# Altium schematic sheet SingleBoardDrone_RP2350.SchDoc
size B; SheetNumber: 2; SheetTotal: 5
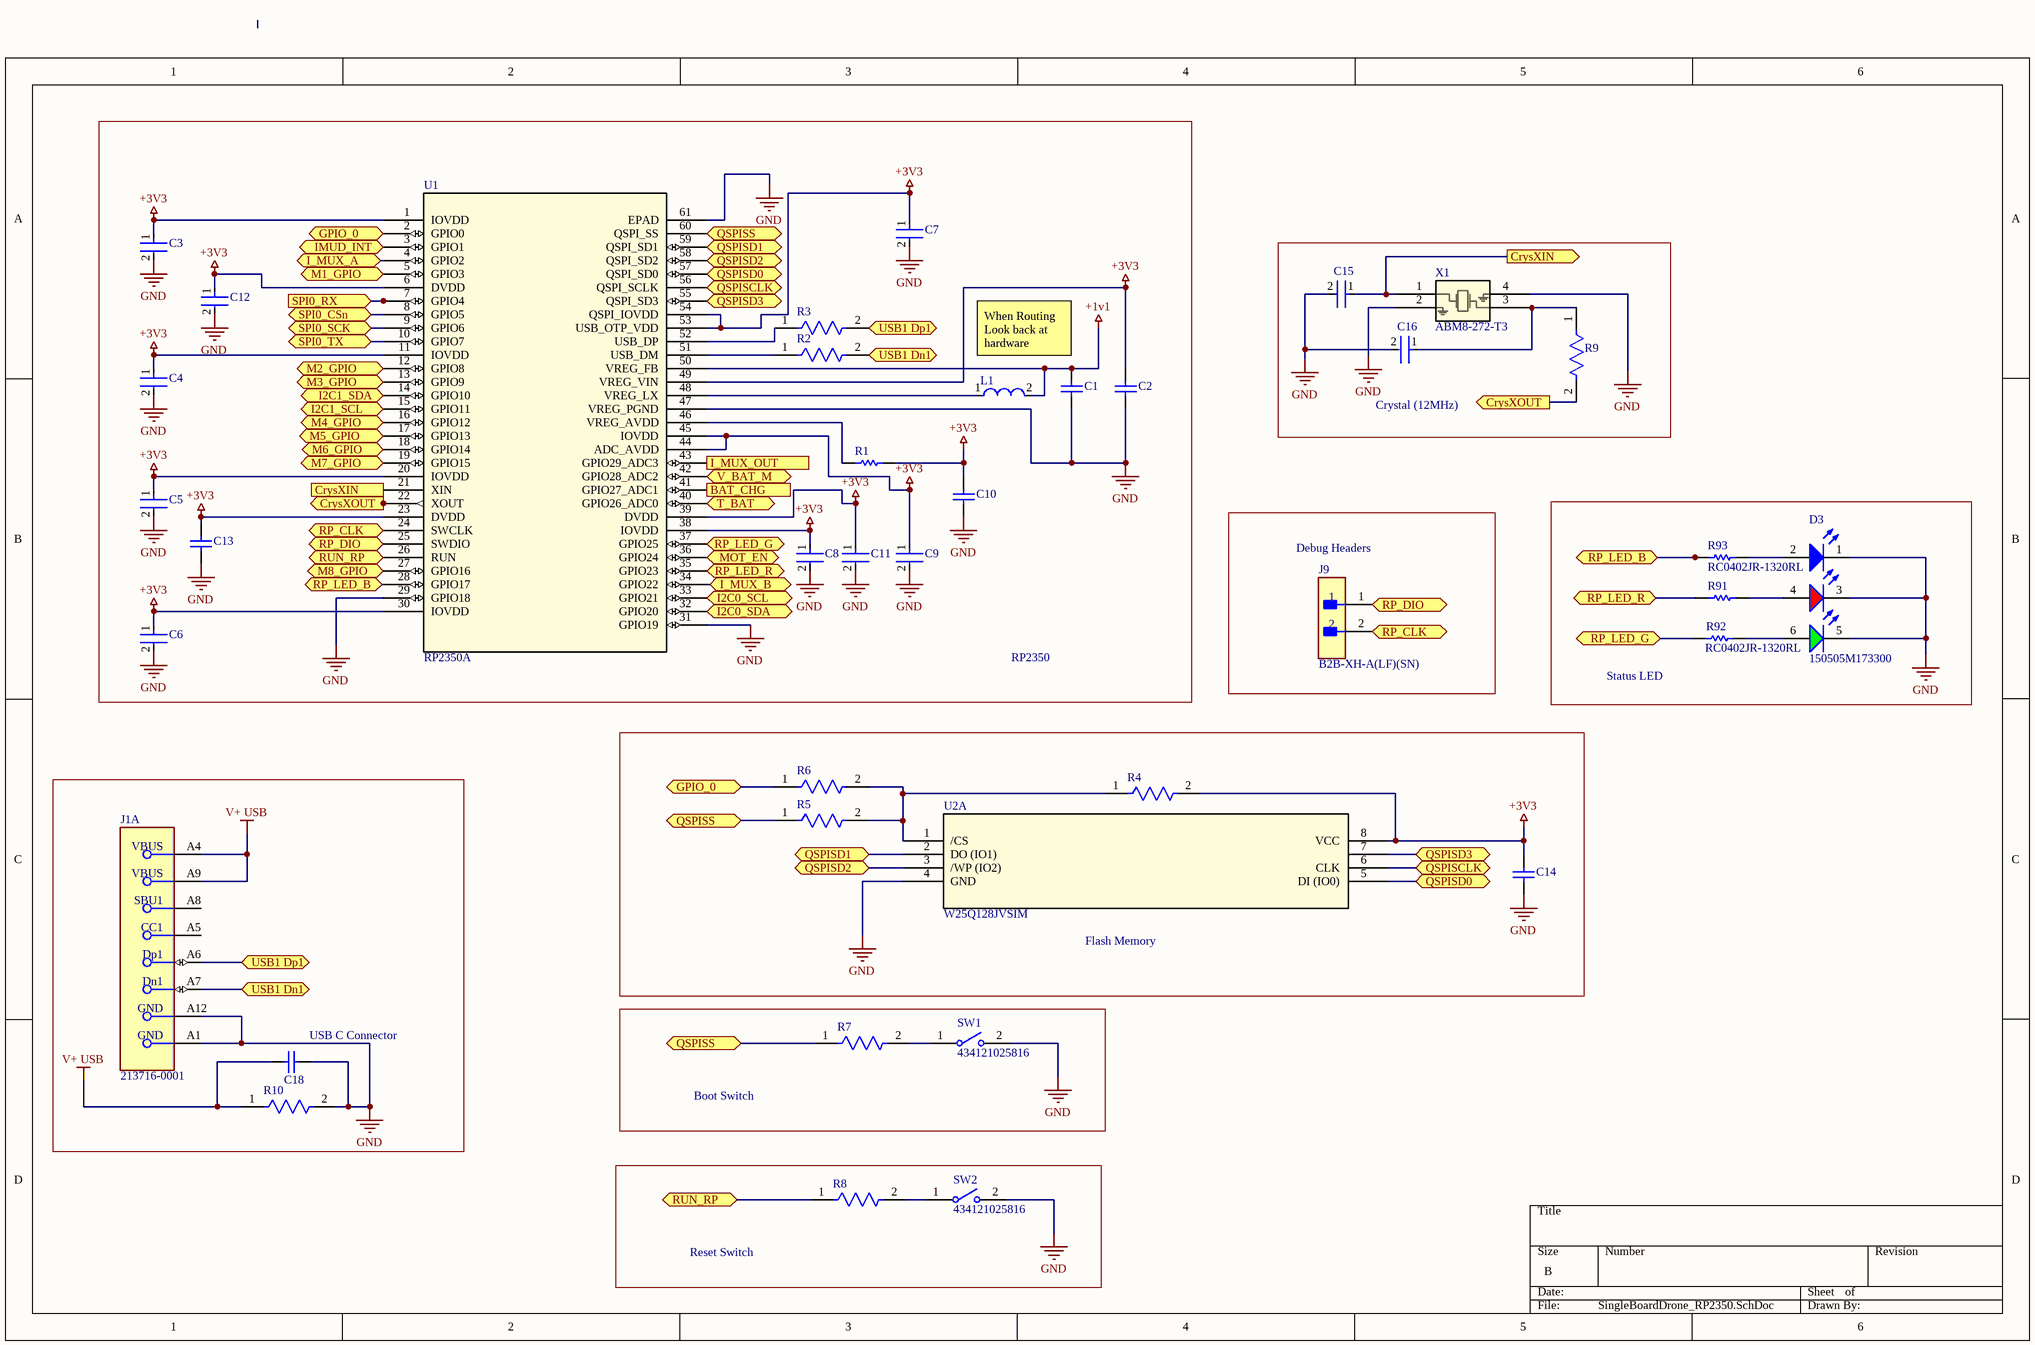
[diagram p0: SingleBoardDrone_RP2350.SchDoc]

## Parts
C1  CL10A475KQ8NNNC  [CAPC1608X90X30LL10T20]  (value not drawn)
C2  CL10A475KQ8NNNC  [CAPC1608X90X30LL10T20]  (value not drawn)
C3  CL03A104KP3NNNC  [FP-CL03-IPC_C]  (value not drawn)
C4  CL03A104KP3NNNC  [FP-CL03-IPC_C]  (value not drawn)
C5  CL03A104KP3NNNC  [FP-CL03-IPC_C]  (value not drawn)
C6  CL03A104KP3NNNC  [FP-CL03-IPC_C]  (value not drawn)
C7  CL03A104KP3NNNC  [FP-CL03-IPC_C]  (value not drawn)
C8  CL03A104KP3NNNC  [FP-CL03-IPC_C]  (value not drawn)
C9  CL03A104KP3NNNC  [FP-CL03-IPC_C]  (value not drawn)
C10  CL10A475KQ8NNNC  [CAPC1608X90X30LL10T20]  (value not drawn)
C11  CL03A104KP3NNNC  [FP-CL03-IPC_C]  (value not drawn)
C12  CL03A104KP3NNNC  [FP-CL03-IPC_C]  (value not drawn)
C13  CL10A475KQ8NNNC  [CAPC1608X90X30LL10T20]  (value not drawn)
C14  CL10A475KQ8NNNC  [CAPC1608X90X30LL10T20]  (value not drawn)
C15  CC0402JRNPO9BN150  [FP-CC0402-0_55-IPC_B]  (value not drawn)
C16  CC0402JRNPO9BN150  [FP-CC0402-0_55-IPC_B]  (value not drawn)
C18  CL10A475KQ8NNNC  [CAPC1608X90X30LL10T20]  (value not drawn)
D3  150505M173300  [WL-SFTW_5050_150505M173300]
J1  213716-0001  [FP-213716-0001-MFG]  (part A of 3)
J9  B2B-XH-A(LF)(SN)  [FP-B2B-XH-A_LF_SN-MFG]
L1  MLZ2012A3R3WT000  [FP-MLZ2012-0_85-IPC_C]  (value not drawn)
R1  RC0603JR-1333RL  [RESC1608X55X25LL10T15]  (value not drawn)
R2  AC0402FR-0727RL  [FP-AC0402-IPC_C]  (value not drawn)
R3  AC0402FR-0727RL  [FP-AC0402-IPC_C]  (value not drawn)
R4  RMCF0603JG10K0  [FP-RMCF0603-MFG]  (value not drawn)
R5  RC0402FR-070RL  [FP-RC0402-0_4-IPC_A]  (value not drawn)
R6  RC0402FR-070RL  [FP-RC0402-0_4-IPC_A]  (value not drawn)
R7  RMCF0402JT1K00  [FP-RMCF0402-IPC_B]  (value not drawn)
R8  RMCF0402JT1K00  [FP-RMCF0402-IPC_B]  (value not drawn)
R9  RMCF0402JT1K00  [FP-RMCF0402-IPC_B]  (value not drawn)
R10  RMCF0603JG10K0  [FP-RMCF0603-MFG]  (value not drawn)
R91  ERJ-3EKF1400V  [RESC1608X55X30NL15T15]  (value not drawn)
R92  RC0402JR-1320RL  [RESC1005X40X25NL05T10]
R93  RC0402JR-1320RL  [RESC1005X40X25NL05T10]
SW1  434121025816  [434121025816]
SW2  434121025816  [434121025816]
U1  RP2350A  [QFN-60_7X7_RPI]
U2  W25Q128JVSIM  [SOIC_128JVSIM_WIN]  (part A of 2)
X1  ABM8-272-T3  [XTAL_ABM8-272-T3]

## Blocks framed on the sheet
RP2350: C1-C13 L1 R1-R3 U1
Crystal (12MHz): C15 C16 R9 X1
Status LED: D3 R91-R93
Debug Headers: J9
Flash Memory: C14 R4-R6 U2
USB C Connector: C18 J1 R10
Boot Switch: R7 SW1
Reset Switch: R8 SW2

## Ports
BAT_CHG (in, see SingleBoardDrone_Pow[2C]), CrysXIN (in, see SingleBoardDrone_RP2350[5A]), CrysXIN (out, see SingleBoardDrone_RP2350[1B]), CrysXOUT (out, see SingleBoardDrone_RP2350[1B]), CrysXOUT (out, see SingleBoardDrone_RP2350[5B]), GPIO_0 (bidir, see SingleBoardDrone_Act[5C], SingleBoardDrone_RP2350[1A]), GPIO_0 (bidir, see SingleBoardDrone_Act[5C], SingleBoardDrone_RP2350[2C]), I2C0_SCL (bidir, see SingleBoardDrone_Sens[3A], SingleBoardDrone_Sens[3C]), I2C0_SDA (bidir, see SingleBoardDrone_Sens[3A], SingleBoardDrone_Sens[3C]), I2C1_SCL (bidir, see SingleBoardDrone_RF[3B]), I2C1_SDA (bidir, see SingleBoardDrone_RF[3B]), I_MUX_A (bidir, see SingleBoardDrone_Act[5C]), I_MUX_B (bidir, see SingleBoardDrone_Act[5C]), I_MUX_OUT (in, see SingleBoardDrone_Act[5D]), IMUD_INT (bidir, see SingleBoardDrone_Sens[2C], SingleBoardDrone_Sens[3B]), M1_GPIO (bidir, see SingleBoardDrone_Act[2A]), M2_GPIO (bidir, see SingleBoardDrone_Act[2A]), M3_GPIO (bidir, see SingleBoardDrone_Act[4A]), M4_GPIO (bidir, see SingleBoardDrone_Act[4A]), M5_GPIO (bidir, see SingleBoardDrone_Act[2C]), M6_GPIO (bidir, see SingleBoardDrone_Act[2C]), M7_GPIO (bidir, see SingleBoardDrone_Act[4C]), M8_GPIO (bidir, see SingleBoardDrone_Act[4C]), MOT_EN (bidir, see SingleBoardDrone_Act[6B]), QSPISCLK (bidir, see SingleBoardDrone_RP2350[3A]), QSPISCLK (bidir, see SingleBoardDrone_RP2350[5C]), QSPISD0 (bidir, see SingleBoardDrone_RP2350[3A]), QSPISD0 (bidir, see SingleBoardDrone_RP2350[5C]), QSPISD1 (bidir, see SingleBoardDrone_RP2350[3A]), QSPISD1 (bidir, see SingleBoardDrone_RP2350[3C]), QSPISD2 (bidir, see SingleBoardDrone_RP2350[3A]), QSPISD2 (bidir, see SingleBoardDrone_RP2350[3C]), QSPISD3 (bidir, see SingleBoardDrone_RP2350[3A]), QSPISD3 (bidir, see SingleBoardDrone_RP2350[5C]), QSPISS (bidir, see SingleBoardDrone_RP2350[2C], SingleBoardDrone_RP2350[2D]), QSPISS (bidir, see SingleBoardDrone_RP2350[2C], SingleBoardDrone_RP2350[3A]), QSPISS (bidir, see SingleBoardDrone_RP2350[2D], SingleBoardDrone_RP2350[3A]), RP_CLK (bidir, see SingleBoardDrone_RP2350[1B]), RP_CLK (bidir, see SingleBoardDrone_RP2350[5B]), RP_DIO (bidir, see SingleBoardDrone_RP2350[1B]), RP_DIO (bidir, see SingleBoardDrone_RP2350[5B]), RP_LED_B (bidir, see SingleBoardDrone_RP2350[1B]), RP_LED_B (bidir, see SingleBoardDrone_RP2350[5B]), RP_LED_G (bidir, see SingleBoardDrone_RP2350[3B]), RP_LED_G (bidir, see SingleBoardDrone_RP2350[5B]), RP_LED_R (bidir, see SingleBoardDrone_RP2350[3B]), RP_LED_R (bidir, see SingleBoardDrone_RP2350[5B]), RUN_RP (bidir, see SingleBoardDrone_RP2350[1B]), RUN_RP (bidir, see SingleBoardDrone_RP2350[2D]), SPI0_CSn (bidir, see SingleBoardDrone_Sens[1A]), SPI0_RX (in, see SingleBoardDrone_Sens[2A]), SPI0_SCK (bidir, see SingleBoardDrone_Sens[1A]), SPI0_TX (bidir, see SingleBoardDrone_Sens[2A]), T_BAT (bidir, see SingleBoardDrone_Pow[1B]), USB1 Dn1 (bidir, see SingleBoardDrone_RP2350[1C]), USB1 Dn1 (bidir, see SingleBoardDrone_RP2350[3A]), USB1 Dp1 (bidir, see SingleBoardDrone_RP2350[1C]), USB1 Dp1 (bidir, see SingleBoardDrone_RP2350[3A]), V_BAT_M (bidir, see SingleBoardDrone_Pow[2A])

## Nets
+1v1: C1.1 L1.2 U1.50(VREG_FB)
+3V3: C2.1 C3.1 C4.1 C5.1 C6.1 C7.1 C8.1 C9.1 C10.1 C11.1 C12.1 C13.1 C14.1 R1.2 R4.2 U1.1(IOVDD) U1.6(DVDD) U1.11(IOVDD) U1.20(IOVDD) U1.23(DVDD) U1.30(IOVDD) U1.38(IOVDD) U1.39(DVDD) U1.44(ADC_AVDD) U1.45(IOVDD) U1.49(VREG_VIN) U1.53(USB_OTP_VDD) U1.54(QSPI_IOVDD) U2.8(VCC)
GND: C1.2 C2.2 C3.2 C4.2 C5.2 C6.2 C7.2 C8.2 C9.2 C10.2 C11.2 C12.2 C13.2 C14.2 C15.2 C16.2 C18.1 D3.1(K) D3.3(K) D3.5(K) J1.A1(GND) J1.A12(GND) R10.2 SW1.2 SW2.2 U1.29(GPIO18) U1.31(GPIO19) U1.47(VREG_PGND) U1.61(EPAD) U2.4(GND) X1.2 X1.4
V+ USB: C18.2 J1.A4(VBUS) J1.A9(VBUS) R10.1
BAT_CHG: U1.41(GPIO27_ADC1) ; port BAT_CHG
CrysXIN: C15.1 U1.21(XIN) X1.1 ; port CrysXIN
CrysXOUT: R9.2 U1.22(XOUT) ; port CrysXOUT
GPIO_0: R6.1 U1.2(GPIO0) ; port GPIO_0
I2C0_SCL: U1.33(GPIO21) ; port I2C0_SCL
I2C0_SDA: U1.32(GPIO20) ; port I2C0_SDA
I2C1_SCL: U1.15(GPIO11) ; port I2C1_SCL
I2C1_SDA: U1.14(GPIO10) ; port I2C1_SDA
I_MUX_A: U1.4(GPIO2) ; port I_MUX_A
I_MUX_B: U1.34(GPIO22) ; port I_MUX_B
I_MUX_OUT: U1.43(GPIO29_ADC3) ; port I_MUX_OUT
IMUD_INT: U1.3(GPIO1) ; port IMUD_INT
M1_GPIO: U1.5(GPIO3) ; port M1_GPIO
M2_GPIO: U1.12(GPIO8) ; port M2_GPIO
M3_GPIO: U1.13(GPIO9) ; port M3_GPIO
M4_GPIO: U1.16(GPIO12) ; port M4_GPIO
M5_GPIO: U1.17(GPIO13) ; port M5_GPIO
M6_GPIO: U1.18(GPIO14) ; port M6_GPIO
M7_GPIO: U1.19(GPIO15) ; port M7_GPIO
M8_GPIO: U1.27(GPIO16) ; port M8_GPIO
MOT_EN: U1.36(GPIO24) ; port MOT_EN
QSPISCLK: U1.56(QSPI_SCLK) U2.6(CLK) ; port QSPISCLK
QSPISD0: U1.57(QSPI_SD0) U2.5(DI_(IO0)) ; port QSPISD0
QSPISD1: U1.59(QSPI_SD1) U2.2(DO_(IO1)) ; port QSPISD1
QSPISD2: U1.58(QSPI_SD2) U2.3(/WP_(IO2)) ; port QSPISD2
QSPISD3: U1.55(QSPI_SD3) U2.7 ; port QSPISD3
QSPISS: R5.1 R7.1 U1.60(QSPI_SS) ; port QSPISS
RP_CLK: J9.2 U1.24(SWCLK) ; port RP_CLK
RP_DIO: J9.1 U1.25(SWDIO) ; port RP_DIO
RP_LED_B: R93.1 U1.28(GPIO17) ; port RP_LED_B
RP_LED_G: R92.1 U1.37(GPIO25) ; port RP_LED_G
RP_LED_R: R91.1 U1.35(GPIO23) ; port RP_LED_R
RUN_RP: R8.1 U1.26(RUN) ; port RUN_RP
SPI0_CSn: U1.8(GPIO5) ; port SPI0_CSn
SPI0_RX: U1.7(GPIO4) ; port SPI0_RX
SPI0_SCK: U1.9(GPIO6) ; port SPI0_SCK
SPI0_TX: U1.10(GPIO7) ; port SPI0_TX
T_BAT: U1.40(GPIO26_ADC0) ; port T_BAT
USB1 Dn1: J1.A7(Dn1) R2.2 ; port USB1 Dn1
USB1 Dp1: J1.A6(Dp1) R3.2 ; port USB1 Dp1
V_BAT_M: U1.42(GPIO28_ADC2) ; port V_BAT_M
NetC16_1: C16.1 R9.1 X1.3
NetD3_2: D3.2(A) R93.2
NetD3_4: D3.4(A) R91.2
NetD3_6: D3.6(A) R92.2
NetL1_1: L1.1 U1.48(VREG_LX)
NetR1_1: R1.1 U1.46(VREG_AVDD)
NetR2_1: R2.1 U1.51(USB_DM)
NetR3_1: R3.1 U1.52(USB_DP)
NetR4_1: R4.1 R5.2 R6.2 U2.1(/CS)
NetR7_2: R7.2 SW1.1
NetR8_2: R8.2 SW2.1

Not connected (* = marked no-connect by the designer): J1 A5(CC1) A8(SBU1)

## Notes on the sheet
- When Routing Look back at hardware guide... they have an ideal oreitnation for the inductor....
  They recomend aota-b201610s3r3-101-t

## Library data of the parts
C1 C2 C10 C13 C14 C18 = CMP-2000-06090-1: Chip Capacitor, 4.7 uF, +/- 10%, 6.3 V, -55 to 85 degC, 0603 (1608 Metric), RoHS, Tape and Reel; Manufacturer: Samsung Electro-Mechanics; Dielectric: X5R; Capacitance: 4700000pF; Rated Voltage: 6.3V; Manufacturer URL: http://www.samsungsem.com/global/index.jsp; Case Size/Dimension: 0603; Package Description: 2-Pin Surface Mount Device, Body 1.60 x 0.80 mm; Datasheet Version: 07/2016; Datasheet URL: http://www.samsungsem.com/kr/support/product-search/mlcc/__icsFiles/afieldfile/2016/08/18/S_CL10A475KQ8NNNC.pdf; Tolerance (%): ±10%; Mounting Technology: SurfaceMount; Package Reference: 0603
C3-C9 C11 C12 = CMP-2010-00672-2: Cap Ceramic 100nF 10V X5R ±10% Pad SMD 0201 +85°C T/R; Radiation Hardening: No; Voltage Rating: 10V; Dielectric: X5R; Length: 0.6mm; Voltage Rating (DC): 10V; Package Quantity: 1; Height: 0.3mm; Width: 0.012inch; Min Operating Temperature: -55°C; Lead Free: Lead Free; Tolerance: 10%; Contact Plating: Tin; Depth: 0.3mm; Max Operating Temperature: 85°C; Case/Package: 0201; Capacitance: 100nF; Mount: Surface Mount; Thickness: 0.013inch; Case Code (Metric): 0603; Case Code (Imperial): 0201; Packaging: Tape and Reel
C15 C16 = CMP-03422-001519-1: CAP CER 15PF 50V C0G/NPO 0402; Insulation Resistance: 100GR; Dielectric Material: Ceramic; Tolerance: 5%; Dielectric: C0G; Width: 0.02inch; Case Code (Imperial): 0402; Voltage Rating (DC): 50V; Case Code (Metric): 1005; REACH SVHC: No SVHC; Mount: Surface Mount; Min Operating Temperature: -55°C; Depth: 0.5mm; Voltage Rating: 50V; Voltage: 50V; Thickness: 0.022inch; Length: 1mm; Max Operating Temperature: 125°C; Lead Free: Lead Free; Capacitance: 15pF; Height: 0.5mm; Packaging: Tape and Reel; Radiation Hardening: No; Package Quantity: 1; Case/Package: 0402; Number of Pins: 2; RoHS Compliant: Yes; Resistor Type: Ceramic; Series: CC; Termination: SMD/SMT
D3 = CMP-03913-90235585-1: 150505M173300 WL-SFTW SMT full-color TOP LED waterclear; Max Reverse Voltage (DC): 5V; Forward Current: 80mA; Max Junction Temperature (Tj): 115°C; Peak Wavelength: 465nm; Color: Blue, Green, Red; Viewing Angle: 120°; Luminous Intensity: 350mcd; Dominant Wavelength: 520nm; Forward Voltage: 2V; Power Dissipation: 72mW; Length: 5.4mm; Width: 5mm; Min Operating Temperature: -40°C; Height: 1.5mm; Packaging: Tape and Reel; Max Operating Temperature: 85°C; RoHS: Compliant; Reverse Voltage: 5V; NexarPartId: 90235585
J1 = CMP-04767-000029-1: CONN RCPT USB2.0 TYPE C 24POS RA
J9 = CMP-2000-05888-3: CONN HEADER VERT 2POS 2.5MM; Current Rating: 3A; Voltage Rating: 250V; Number of Contacts: 2; Contact Resistance: 20mR; Wire/Cable Gauge: 22AWG; Insulation Resistance: 1GR; Connector Type: Male Pin; Packaging: Bulk; Contact Material: Brass; Lead Free: Lead Free; Orientation: Straight; Contact Plating: Tin; Max Current Rating: 3A; Termination: Solder; Fastening Type: Detent; Depth: 5.75mm; Housing Material: Polyamide; REACH SVHC: No SVHC; Series: XH; Voltage Rating (AC): 250V; Number of Positions: 2; Color: Natural; Contact Type: Male Pin; Max Voltage Rating (DC): 250V; Pitch: 2.5mm; Lead Pitch: 2.5mm; Mount: Through Hole; Max Operating Temperature: 85°C; Length: 7.4mm; Max Voltage Rating (AC): 250V; Min Operating Temperature: -25°C; Number of Rows: 1; Housing Color: White
L1 = CMP-08253-000308-1: Shielded Multilayer Inductor 3.3uH ±20% 450mA 442mΩ SMD 0805; Saturation Current: 200mA; Self Resonant Frequency: 90MHz; DC Resistance (DCR): 442mR; Core Material: Ferrite; Test Frequency: 10MHz; Current Rating: 450mA; Shielding: Shielded; Lead Free: Lead Free; Length: 0.079inch; Inductance: 3.3uH; Max Operating Temperature: 125°C; Height - Seated (Max): 0.041inch; Tolerance: 20%; Mount: Surface Mount; Package Quantity: 1; Case/Package: 0805; Case Code (Metric): 2012; Min Operating Temperature: -55°C; Packaging: Cut Tape; RoHS Compliant: Yes; Case Code (Imperial): 0805; Width: 0.049inch
R1 = CMP-2000-04324-1: Manufacturer: Yageo; Part Number: RC0603JR-1333RL
R2 R3 = CMP-03412-005338-2: RES 27Ω ±1% 0.063W 0402; Temperature Coefficient: 100ppm/°C; Max Power Dissipation: 63mW; Resistance: 27R; Series: AC; Tolerance: 1%; Length: 0.039inch; Number of Terminations: 2; Case/Package: 0402; Features: Moisture Resistant; Min Operating Temperature: -55°C; Max Operating Temperature: 155°C; Resistor Type: Thick Film; Width: 0.02inch; RoHS Compliant: Yes; Packaging: Tape and Reel; Height: 0.015inch
R4 R10 = CMP-26527-000153-1: 10kΩ ±5% 0.1W 0603 Thick Film Chip Resistor AEC-Q200 compliant; Temperature Coefficient: 200ppm/°C; Resistance: 10kR; Max Power Dissipation: 100mW; Tolerance: 5%; Case Code (Imperial): 0603; Series: RMCF; Resistor Type: Thick Film; Length: 0.061inch; Features: Automotive AEC-Q200; Height: 0.022inch; Case Code (Metric): 1608; Width: 0.031inch; Number of Terminations: 2; Contact Plating: Tin; Case/Package: 0603; Package Quantity: 1; Max Operating Temperature: 155°C; Mount: Surface Mount; RoHS Compliant: Yes; Radiation Hardening: No; Min Operating Temperature: -55°C; Packaging: Tape and Reel
R5 R6 = CMP-2002-07342-2: RES SMD 0 OHM JUMPER 1/16W 0402; Resistance: 0R; Temperature Coefficient: 200ppm/°C; Tolerance: 1%; Power Rating: 62.5mW; Voltage Rating: 50V; Max Power Dissipation: 63mW; Features: Moisture Resistant; Length: 1mm; Case Code (Metric): 1005; Series: RC; RoHS Compliant: Yes; Resistor Type: Thick Film; Height: 0.35mm; Min Operating Temperature: -55°C; Case Code (Imperial): 0402; Number of Terminations: 2; Contact Plating: Tin; Case/Package: 0402; Size Code: 0402; Termination: SMD/SMT; Max Operating Temperature: 155°C; Width: 0.5mm; Mount: Surface Mount; Lead Free: Lead Free; Packaging: Tape and Reel; Radiation Hardening: No
R7-R9 = CMP-26527-000131-1: 1kΩ ±5% 0.063W 0402 Thick Film Chip Resistor AEC-Q200 compliant; Power Rating: 62.5mW; Max Power Dissipation: 63mW; Temperature Coefficient: 100ppm/°C; Resistance: 1kR; Mount: Surface Mount; Min Operating Temperature: -55°C; Construction: Rectangular; Case/Package: 0402; Contact Plating: Tin; Case Code (Metric): 1005; Features: Automotive AEC-Q200; Series: RMCF; Lead Free: Lead Free; Length: 1mm; Case Code (Imperial): 0402; Depth: 0.5mm; Resistor Type: Thick Film; Packaging: Tape and Reel; Height: 0.016inch; Width: 0.02inch; Tolerance: 5%; Size Code: 0402; RoHS Compliant: Yes; Number of Terminations: 2; Max Operating Temperature: 155°C; Radiation Hardening: No; Military Standard: Not
R91 = CMP-2000-00245-1: Manufacturer: Panasonic; Part Number: ERJ-3EKF1400V
R92 R93 = CMP-2002-08072-1: Manufacturer: Yageo; Part Number: RC0402JR-1320RL
SW1 SW2 = CMP-1459-00004-3: Switch Tactile Spst-no 0.05A 12V; Operating Force: 1.56N; Contact Resistance: 100mΩ; Switch Function: Off-Mom; Mechanical Life: 50kcycles; Switch Travel: 250µm; Actuator Material: Liquid Crystal Polymer, Polymer; Current Rating: 50mA; Throw Configuration: SPST; Actuator Length: 800µm; Illumination Type: Illuminated, Non-Illuminated; Color: Black; Height: 2.5mm; Contact Material: Stainless Steel, Steel; Voltage Rating: 12V; Packaging: Tape and Reel; Contact Plating: Silver; Max Operating Temperature: 85°C; RoHS: Compliant; Lead Free: Lead Free; Termination: SMD/SMT; REACH SVHC: No SVHC; Mount: Surface Mount; Min Operating Temperature: -40°C; Length: 7.3mm; Insulation Resistance: 100MΩ; Contact Current Rating: 50mA
U1 = RP2350A: No Description Available; Manufacturer_Name: Raspberry Pi; Copyright: Copyright (C) 2025 Ultra Librarian. All rights reserved.; Manufacturer_Part_Number: RP2350A; RefDes: RefDes; Type: Type
U2 = W25Q128JVSIM: No Description Available; Manufacturer_Name: Winbond; Copyright: Copyright (C) 2025 Ultra Librarian. All rights reserved.; Manufacturer_Part_Number: W25Q128JVSIM; RefDes: RefDes; Type: Type
X1 = ABM8-272-T3: No Description Available; Manufacturer_Name: Abracon; Type: Crystals; Copyright: Copyright (C) 2025 Ultra Librarian. All rights reserved.; Manufacturer_Part_Number: ABM8-272-T3; RefDes: RefDes